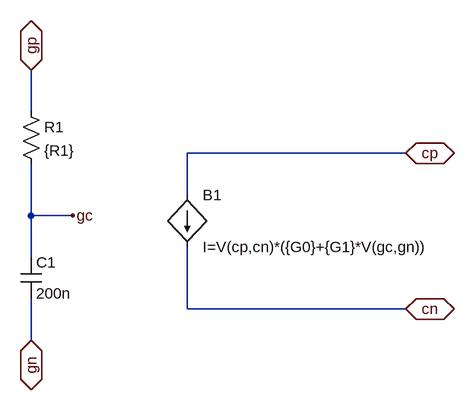
[diagram p0: schematic gasSensor_Paul.asc]
gasSensor_Paul.asc, the LTspice schematic file:
Version 4
SHEET 1 880 680
WIRE -240 -48 -240 -112
WIRE 336 16 0 16
WIRE 0 80 0 16
WIRE -240 112 -240 32
WIRE -176 112 -240 112
WIRE -240 176 -240 112
WIRE 0 256 0 160
WIRE 336 256 0 256
WIRE -240 304 -240 240
FLAG 336 16 cp
IOPIN 336 16 BiDir
FLAG 336 256 cn
IOPIN 336 256 BiDir
FLAG -176 112 gc
FLAG -240 -112 gp
IOPIN -240 -112 BiDir
FLAG -240 304 gn
IOPIN -240 304 BiDir
SYMBOL bi 0 80 R0
SYMATTR InstName B1
SYMATTR Value I=V(cp,cn)*({G0}+{G1}*V(gc,gn))
SYMBOL res -256 -64 R0
SYMATTR InstName R1
SYMATTR Value {R1}
SYMBOL cap -256 176 R0
SYMATTR InstName C1
SYMATTR Value 200n

The netlist it stands for:
* gasSensor_Paul.asc
B1 cp cn I=V(cp,cn)*({G0}+{G1}*V(gc,gn))
R1 gp gc {R1}
C1 gc gn 200n
.backanno
.end